# EasyEDA schematic easyeda.json
TITLE: Solis4Gmini-Logger; REV: 1.0; Date: 2021-04-12; Sheet: 1/1; Drawn By: 10k-resistor
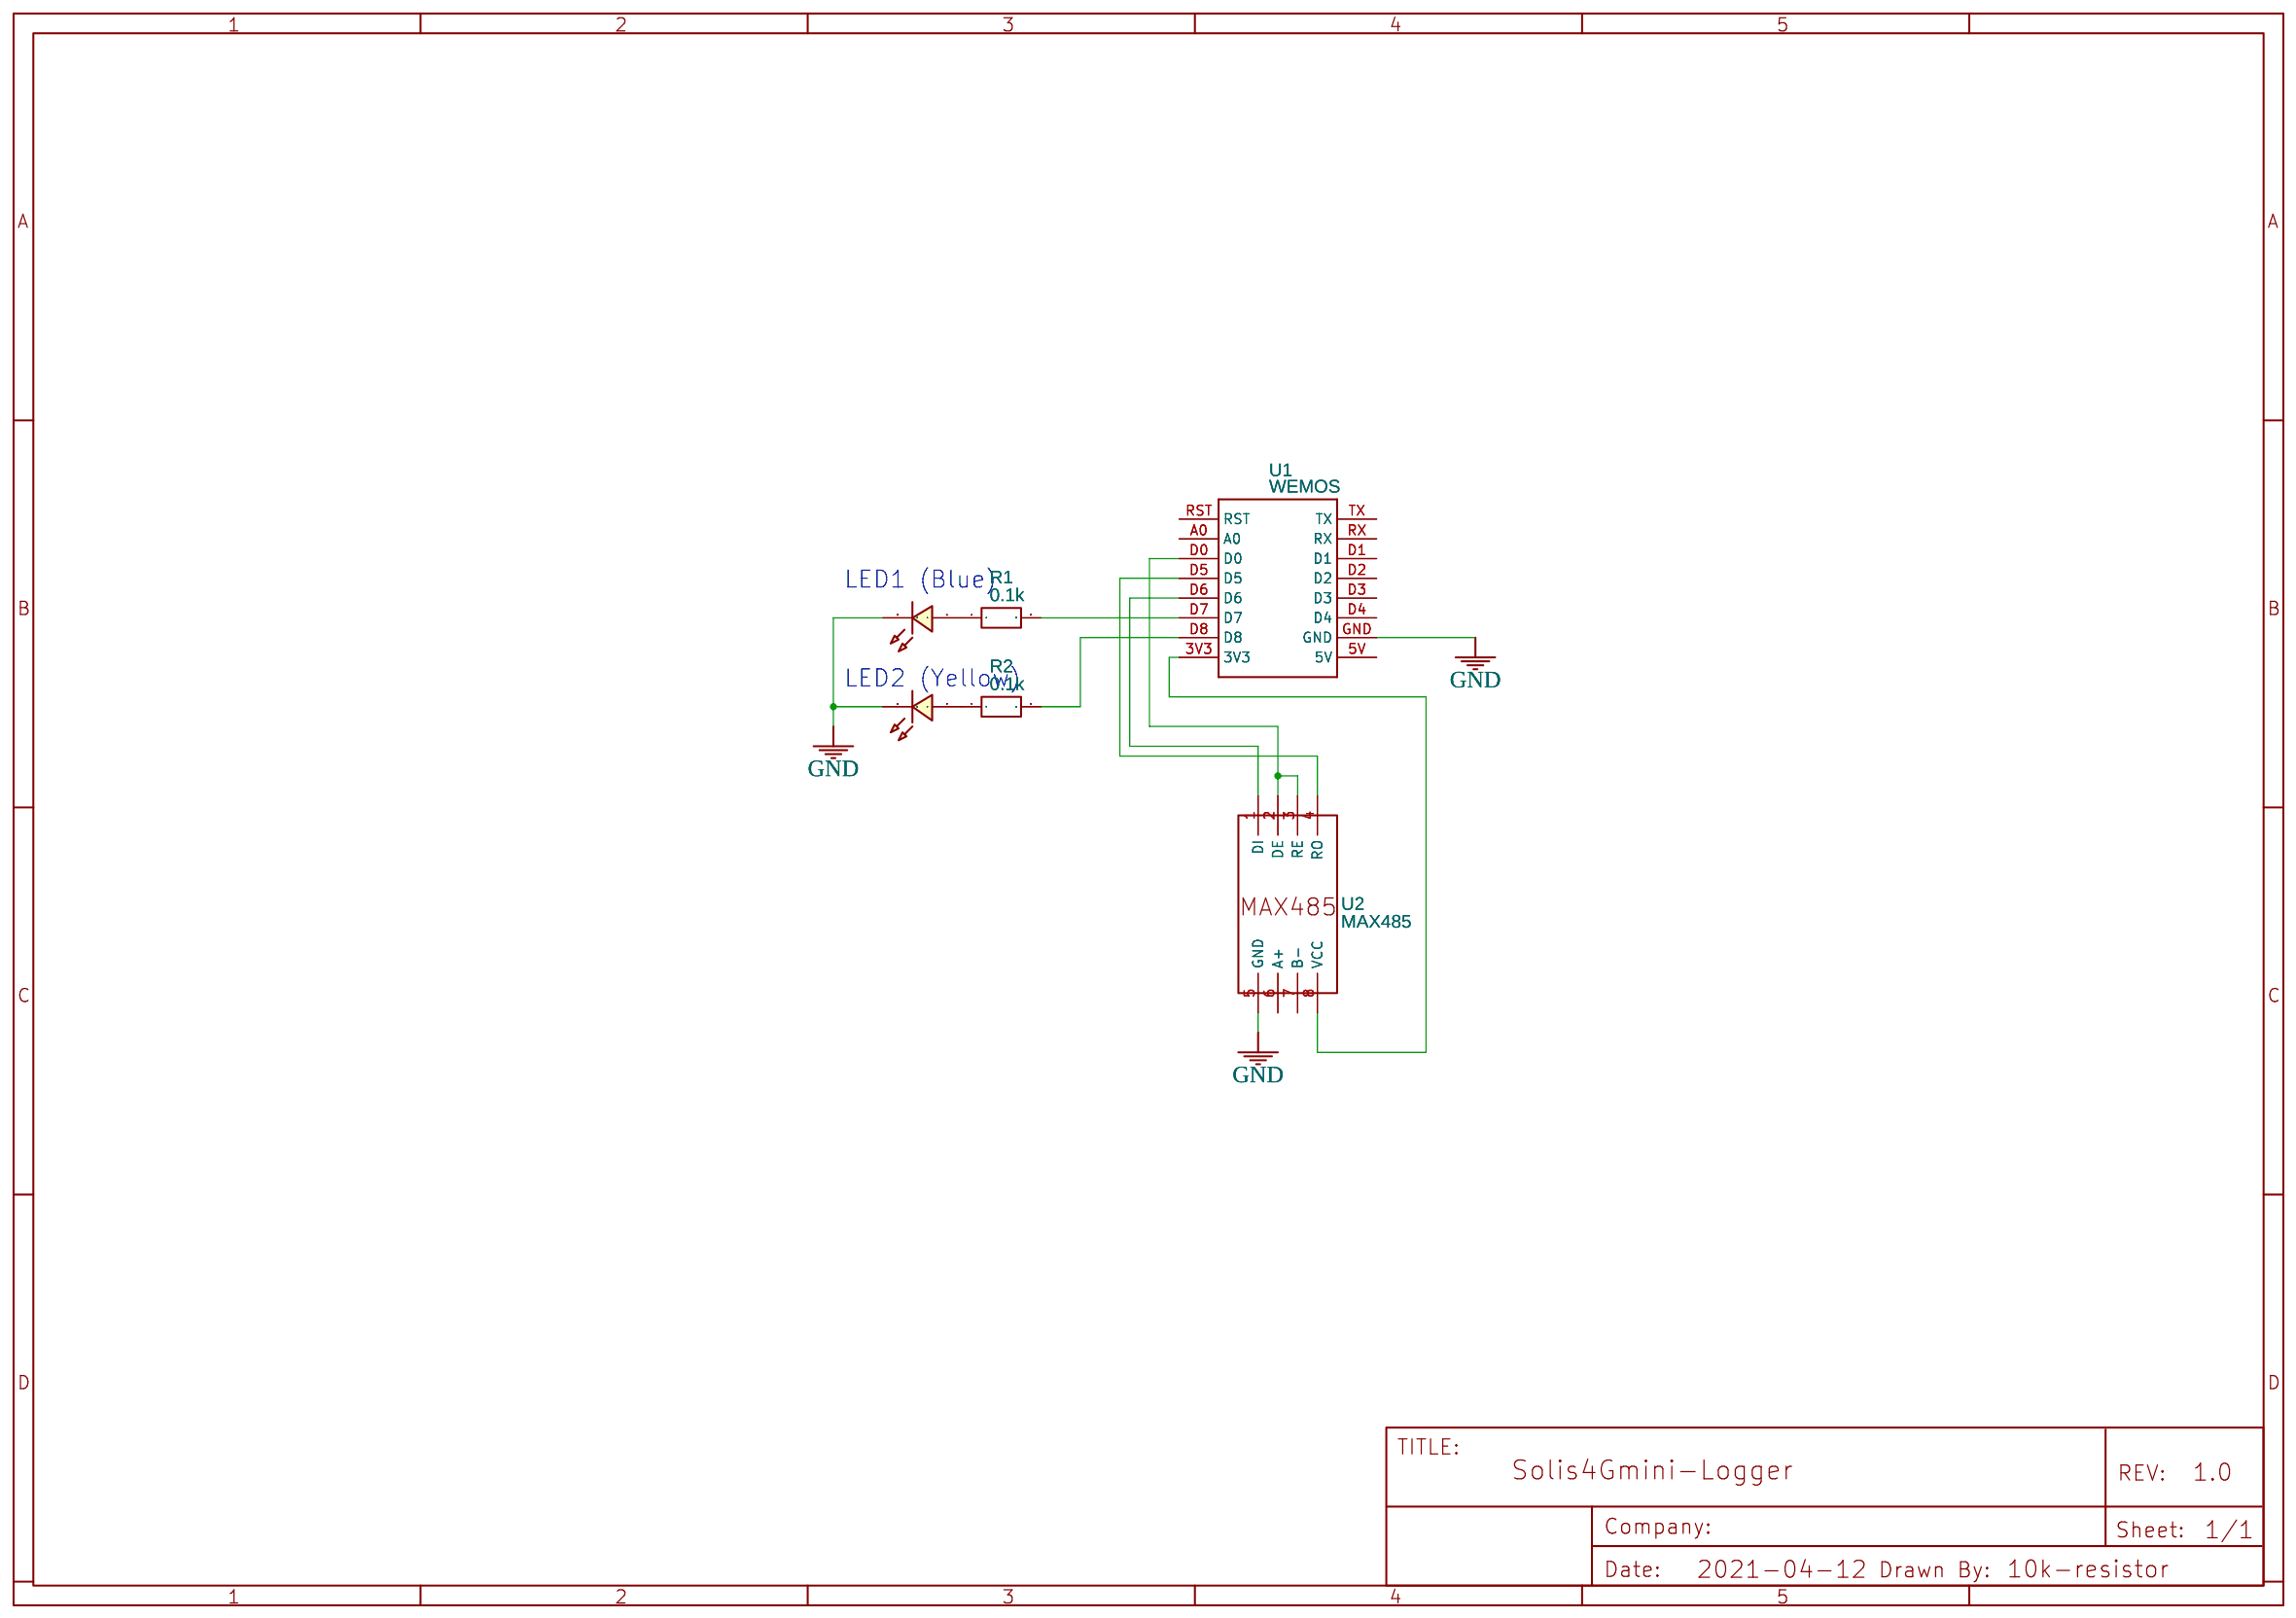
[diagram p0: schematic sheet]

## Parts
LED1  LED-0603_R  [LED0603_RED]
LED2  LED-0603_R  [LED0603_RED]
R1  0.1k  [R0603]
R2  0.1k  [R0603]
U1  WEMOS  [WEMOS]
U2  MAX485  [MAX485]

## Library data of the parts
LED1 LED2 = LED-0603_R: Manufacturer: EVERLIGHT(台湾亿光); Manufacturer Part: 19-217/R6C-AL1M2VY/3T; Supplier Part: C72044; Supplier: LCSC; Contributor: LCEDA_01
R1 R2 = R_0603_EU: Contributor: LCEDA_Lib
U1 = WEMOS
U2 = MAX485: Contributor: pae2018

## Nets
GND: LED1.2 LED2.2 U1.GND U2.5(GND)
Net-(LED1-1): LED1.1 R1.1
Net-(LED2-1): LED2.1 R2.1
Net-(R1-2): R1.2 U1.D7
Net-(R2-2): R2.2 U1.D8
Net-(U1-3V3): U1.3V3 U2.8(VCC)
Net-(U1-D0): U1.D0 U2.2(DE) U2.3(RE)
Net-(U1-D5): U1.D5 U2.4(RO)
Net-(U1-D6): U1.D6 U2.1(DI)

Not connected (* = marked no-connect by the designer): U1 5V A0 D1 D2 D3 D4 RST RX TX; U2 6(A+) 7(B-)

## Notes on the sheet
- LED1 (Blue)
- LED2 (Yellow)
